# Altium schematic sheet 15-MT7688AN Ethernet-E.SchDoc
size A4
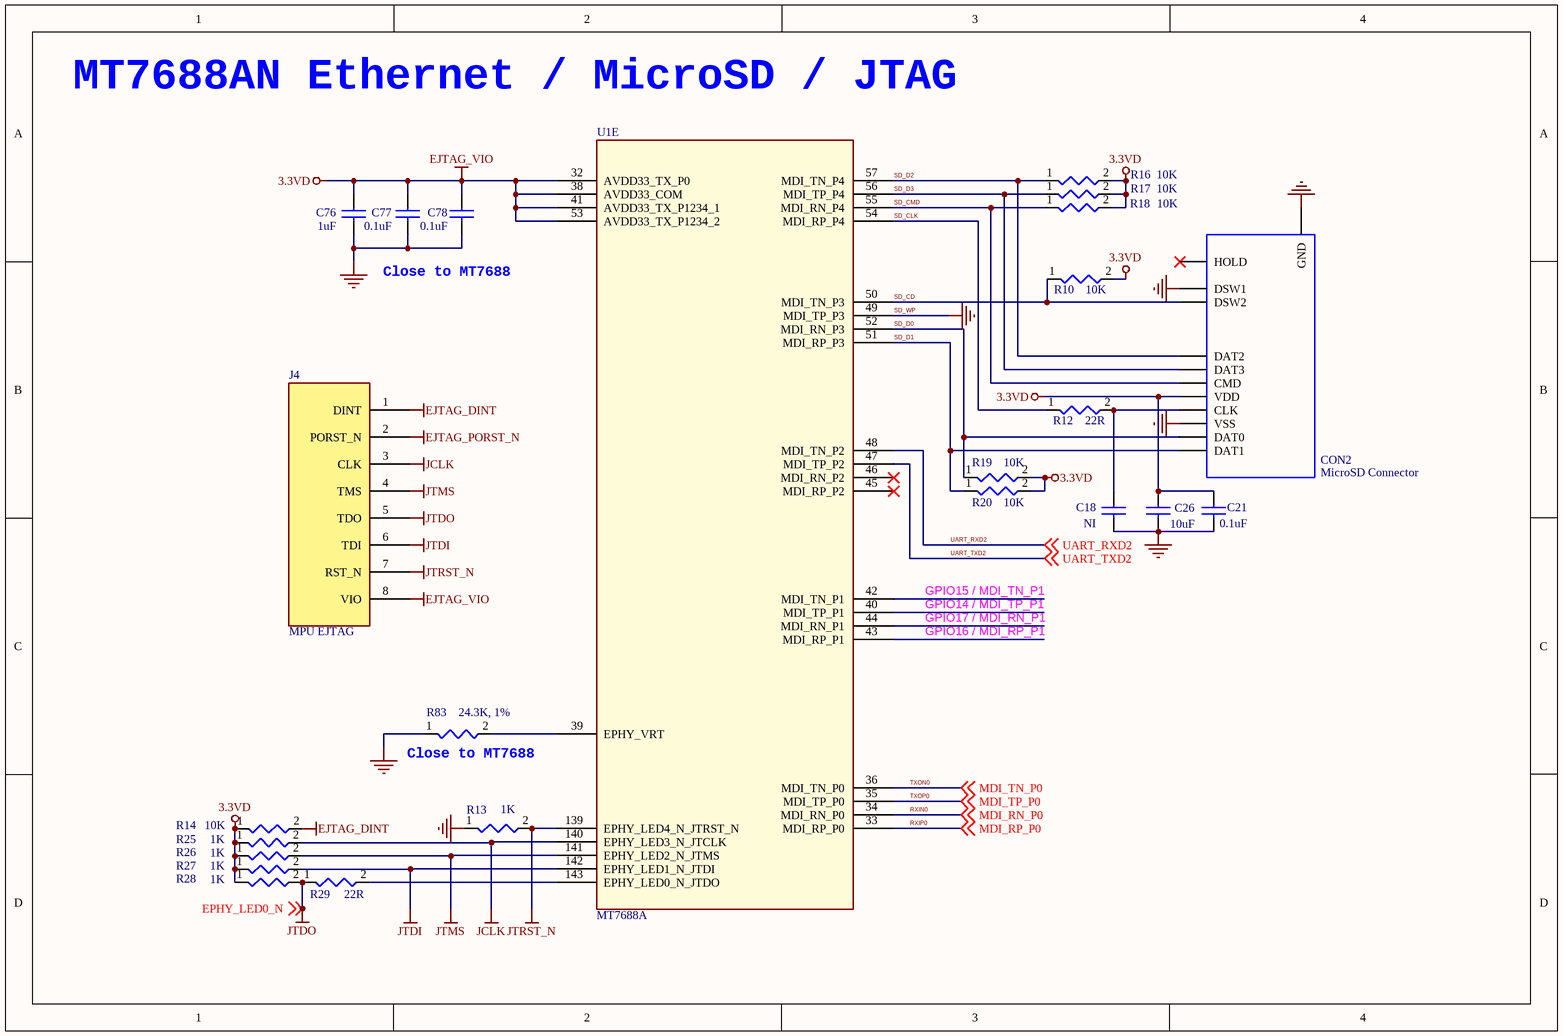
[diagram p0: 15-MT7688AN Ethernet-E.SchDoc]

## Parts
C18  NI  [RLC 0201 M35]
C21  0.1uF  [RLC 0201 M35]
C26  10uF  [RLC 0402 M35]
C76  1uF  [RLC 0201 M35]
C77  0.1uF  [RLC 0201 M35]
C78  0.1uF  [RLC 0201 M35]
CON2  MicroSD Connector  [MICROSD-ST11S008V4H]
J4  MPU EJTAG  [MPU EJTAG]
R10  10K  [RLC 0201 M35]
R12  22R  [RLC 0201 M35]
R13  1K  [RLC 0201 M35]
R14  10K  [RLC 0201 M35]
R16  10K  [RLC 0201 M35]
R17  10K  [RLC 0201 M35]
R18  10K  [RLC 0201 M35]
R19  10K  [RLC 0201 M35]
R20  10K  [RLC 0201 M35]
R25  1K  [RLC 0201 M35]
R26  1K  [RLC 0201 M35]
R27  1K  [RLC 0201 M35]
R28  1K  [RLC 0201 M35]
R29  22R  [RLC 0201 M35]
R83  24.3K, 1%  [RLC 0201 M35]
U1  MT7688A  [MT7628AN$2F$DRQFN156$2F$SMD$2F$P0.5$2F$12X12]  (part E of 6)

## Nets
3.3VD: C21.1 C26.1 C76.1 C77.1 C78.1 CON2.4(VDD) J4.8(VIO) R10.2 R14.1 R16.2 R17.2 R18.2 R19.2 R20.2 R25.1 R26.1 R27.1 R28.1 U1.32(AVDD33_TX_P0) U1.38(AVDD33_COM) U1.41(AVDD33_TX_P1234_1) U1.53(AVDD33_TX_P1234_2)  [also labelled EJTAG_VIO]
EJTAG_DINT: J4.1(DINT) R14.2
EJTAG_PORST_N: J4.2(PORST_N)
JCLK: J4.3(CLK) R25.2 U1.140(EPHY_LED3_N_JTCLK)
JTDI: J4.6(TDI) R27.2 U1.142(EPHY_LED1_N_JTDI)
JTDO: J4.5(TDO) R28.2 R29.1 ; off-sheet EPHY_LED0_N  [also labelled EPHY_LED0_N]
JTMS: J4.4(TMS) R26.2 U1.141(EPHY_LED2_N_JTMS)
JTRST_N: J4.7(RST_N) R13.2 U1.139(EPHY_LED4_N_JTRST_N)
SD_WP: C18.2 C21.2 C26.2 C76.2 C77.2 C78.2 CON2.6(VSS) CON2.11(DSW1) CON2.14(GND) R13.1 R83.1 U1.49(MDI_TP_P3)  [also labelled GND]
GPIO14 / MDI_TP_P1: U1.40(MDI_TP_P1)
GPIO15 / MDI_TN_P1: U1.42(MDI_TN_P1)
GPIO16 / MDI_RP_P1: U1.43(MDI_RP_P1)
GPIO17 / MDI_RN_P1: U1.44(MDI_RN_P1)
RXIN0: U1.34(MDI_RN_P0) ; off-sheet MDI_RN_P0  [also labelled MDI_RN_P0]
RXIP0: U1.33(MDI_RP_P0) ; off-sheet MDI_RP_P0  [also labelled MDI_RP_P0]
SD_CD: CON2.10(DSW2) R10.1 U1.50(MDI_TN_P3)
SD_CLK: R12.1 U1.54(MDI_RP_P4)
SD_CMD: CON2.3(CMD) R18.1 U1.55(MDI_RN_P4)
SD_D0: CON2.7(DAT0) R19.1 U1.52(MDI_RN_P3)
SD_D1: CON2.8(DAT1) R20.1 U1.51(MDI_RP_P3)
SD_D2: CON2.1(DAT2) R16.1 U1.57(MDI_TN_P4)
SD_D3: CON2.2(DAT3) R17.1 U1.56(MDI_TP_P4)
TXON0: U1.36(MDI_TN_P0) ; off-sheet MDI_TN_P0  [also labelled MDI_TN_P0]
TXOP0: U1.35(MDI_TP_P0) ; off-sheet MDI_TP_P0  [also labelled MDI_TP_P0]
UART_RXD2: U1.48(MDI_TN_P2) ; off-sheet UART_RXD2
UART_TXD2: U1.47(MDI_TP_P2) ; off-sheet UART_TXD2
NetC18_1: C18.1 CON2.5(CLK) R12.2
NetR29_2: R29.2 U1.143(EPHY_LED0_N_JTDO)
NetR83_2: R83.2 U1.39(EPHY_VRT)

Not connected (* = marked no-connect by the designer): CON2 12(HOLD)*; U1 45(MDI_RP_P2)* 46(MDI_RN_P2)*

## Notes on the sheet
- MT7688AN Ethernet / MicroSD / JTAG
- Close to MT7688
- (near R83) Close to MT7688

## Library data of the parts
C18 C21 C26 C76-C78 = CAP NP
CON2 = MicroSD-ST11S008V4H: Micro SD Card H=1.25 (ST11S008V4H)
R10 R12-R14 R16-R20 R25-R29 R83 = RES/0402_3
U1 = MT7620N-n_26